# EAGLE schematic Register_file (EAGLE 9.4.2)
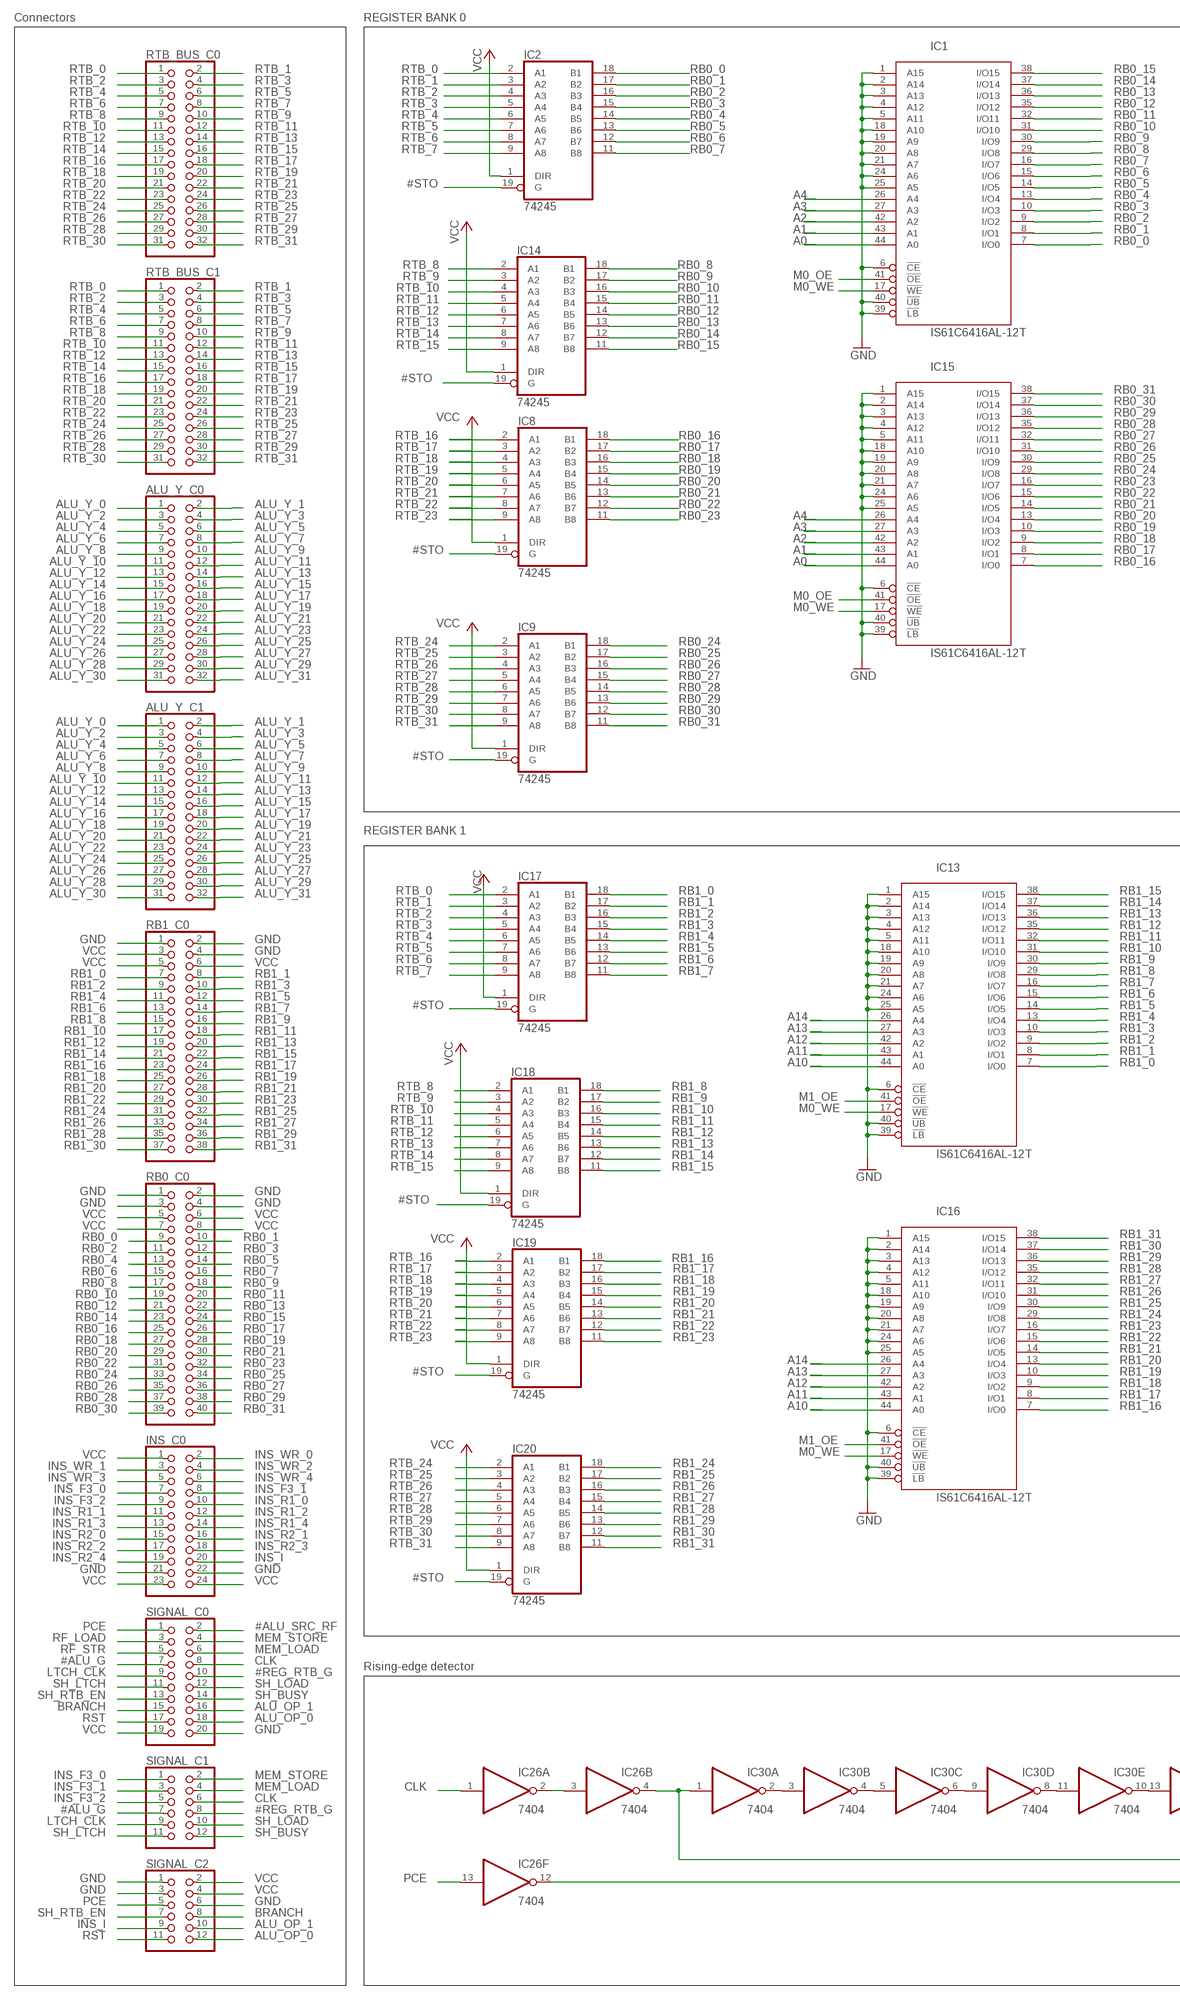
[diagram p0: schematic, sheet 1, part 1 of 2]
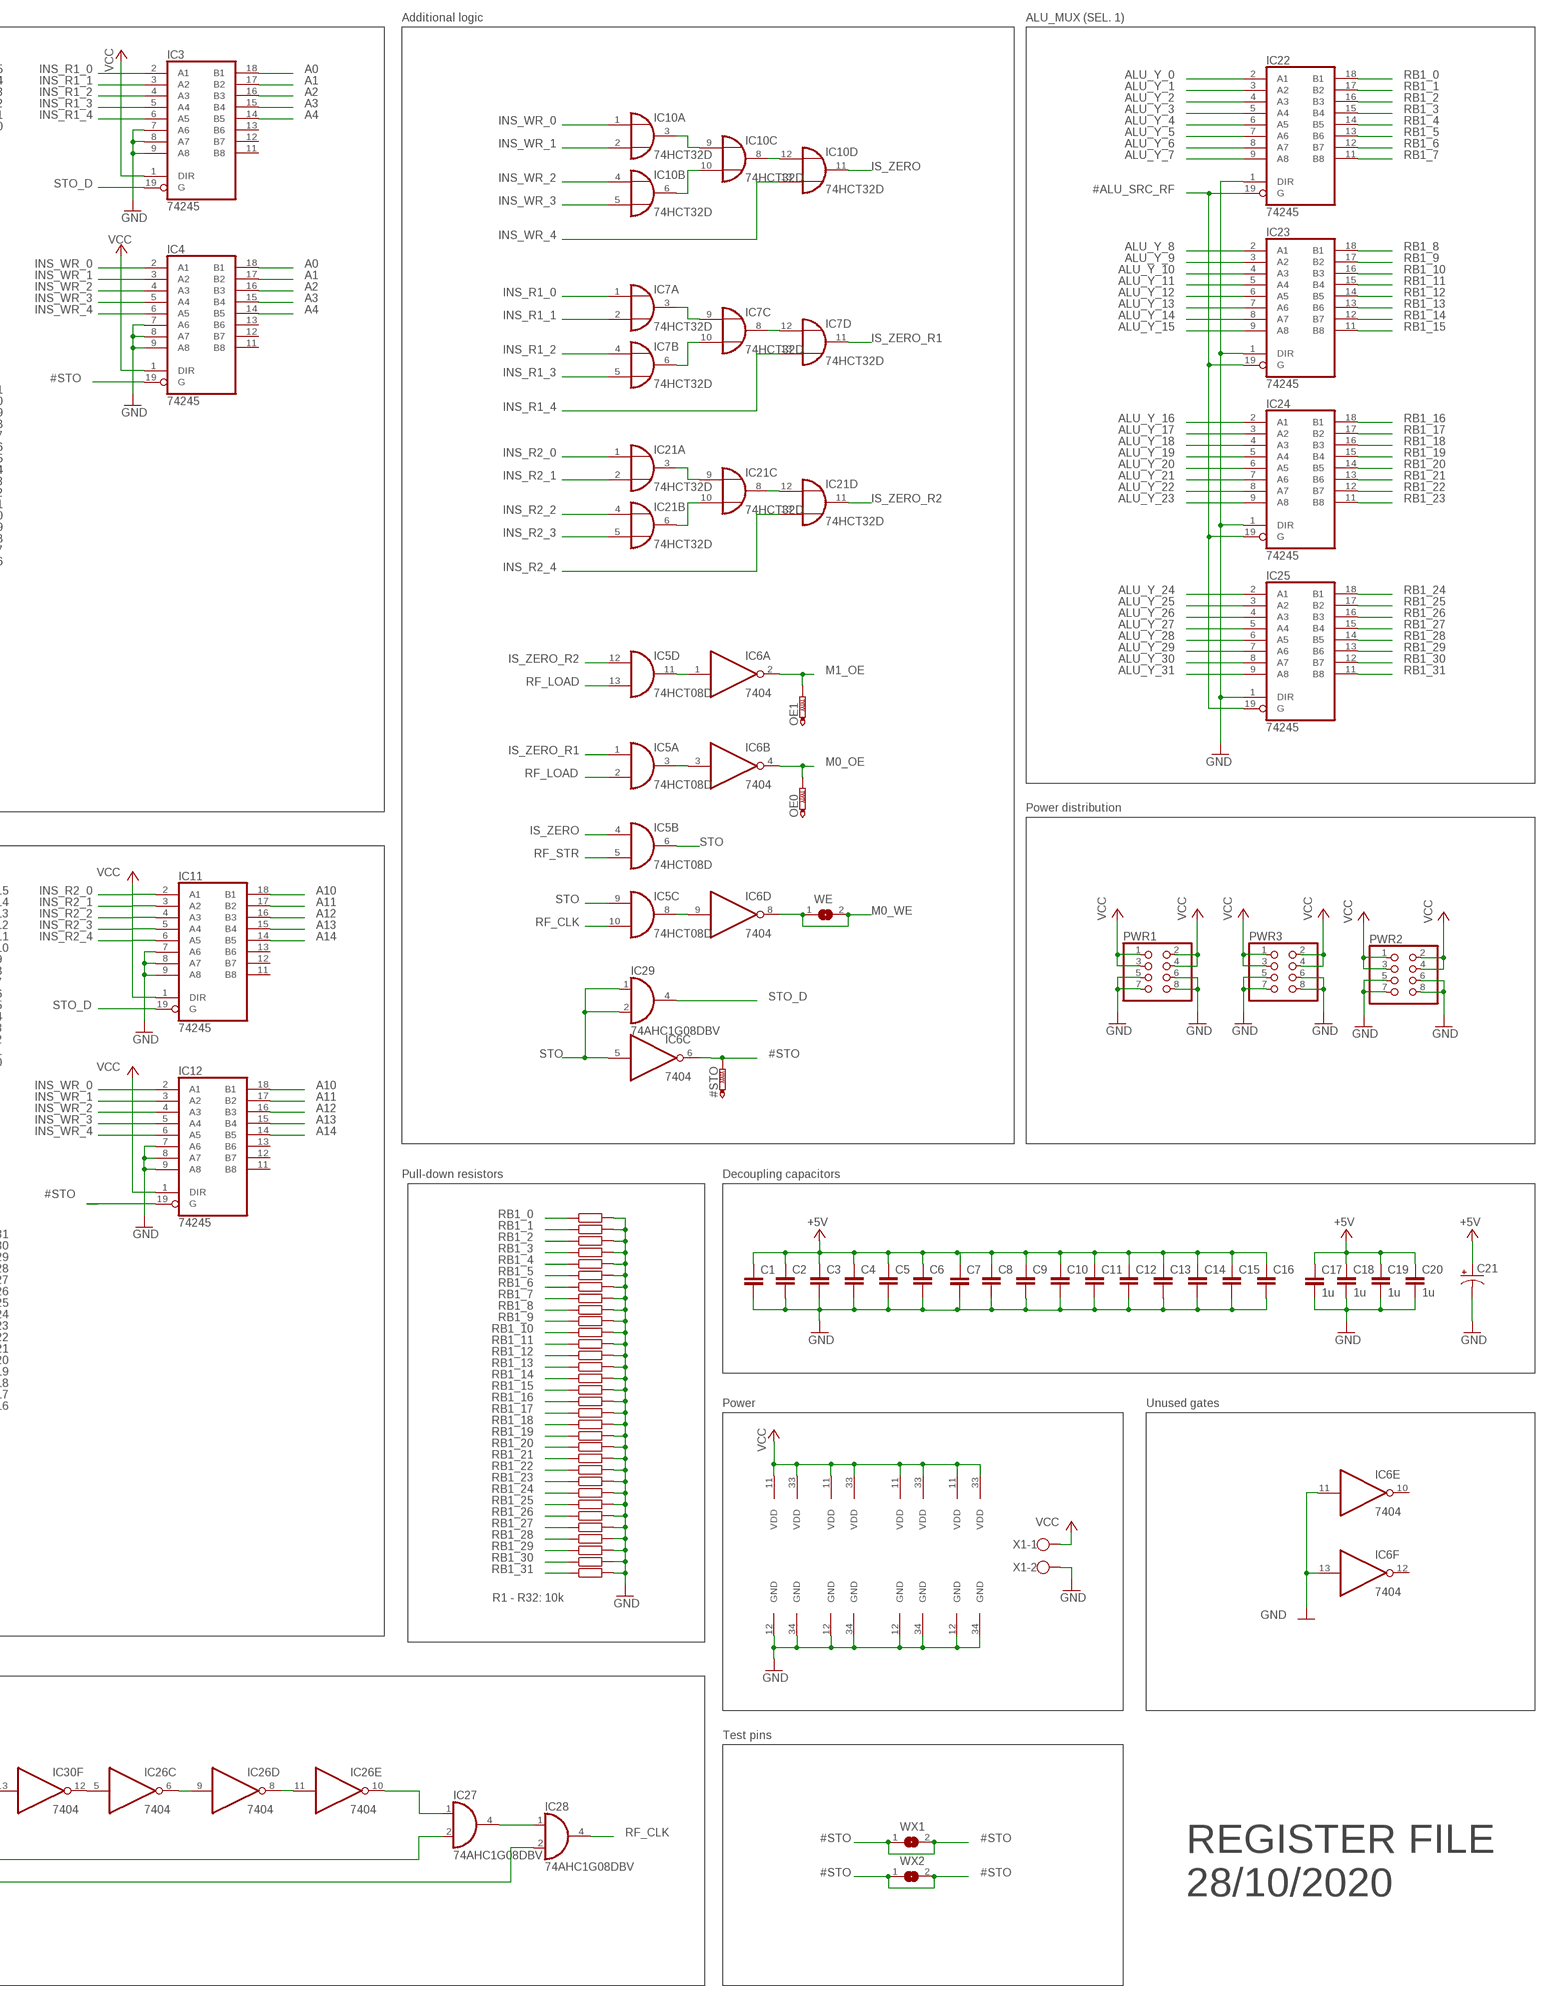
[diagram p1: schematic, sheet 1, part 2 of 2]

## Parts
#STO  PTR1B2,54  [B2,54]
ALU_Y_C0  PINHD-2X16  [2X16]
ALU_Y_C1  PINHD-2X16  [2X16]
C1  C-EUC0805  [C0805]
C2  C-EUC0805  [C0805]
C3  C-EUC0805  [C0805]
C4  C-EUC0805  [C0805]
C5  C-EUC0805  [C0805]
C6  C-EUC0805  [C0805]
C7  C-EUC0805  [C0805]
C8  C-EUC0805  [C0805]
C9  C-EUC0805  [C0805]
C10  C-EUC0805  [C0805]
C11  C-EUC0805  [C0805]
C12  C-EUC0805  [C0805]
C13  C-EUC0805  [C0805]
C14  C-EUC0805  [C0805]
C15  C-EUC0805  [C0805]
C16  C-EUC0805  [C0805]
C17  1u  C-EUC0805  [C0805]
C18  1u  C-EUC0805  [C0805]
C19  1u  C-EUC0805  [C0805]
C20  1u  C-EUC0805  [C0805]
C21  CAPACITOR-P153CLV-1010  [153CLV-1010]
IC1  IS61C6416AL-12T  [TSOP-II-44]
IC2  74245  [TSSOP20]
IC3  74245  [TSSOP20]
IC4  74245  [TSSOP20]
IC5  74HCT08D  [SO14]
IC6  7404  [TSSOP14]
IC7  74HCT32D  [SO14]
IC8  74245  [TSSOP20]
IC9  74245  [TSSOP20]
IC10  74HCT32D  [SO14]
IC11  74245  [TSSOP20]
IC12  74245  [TSSOP20]
IC13  IS61C6416AL-12T  [TSOP-II-44]
IC14  74245  [TSSOP20]
IC15  IS61C6416AL-12T  [TSOP-II-44]
IC16  IS61C6416AL-12T  [TSOP-II-44]
IC17  74245  [TSSOP20]
IC18  74245  [TSSOP20]
IC19  74245  [TSSOP20]
IC20  74245  [TSSOP20]
IC21  74HCT32D  [SO14]
IC22  74245  [TSSOP20]
IC23  74245  [TSSOP20]
IC24  74245  [TSSOP20]
IC25  74245  [TSSOP20]
IC26  7404  [TSSOP14]
IC27  74AHC1G08DBV  [SOT23-5]
IC28  74AHC1G08DBV  [SOT23-5]
IC29  74AHC1G08DBV  [SOT23-5]
IC30  7404  [TSSOP14]
INS_C0  PINHD-2X12  [2X12]
OE0  PTR1B2,54  [B2,54]
OE1  PTR1B2,54  [B2,54]
PWR1  PINHD-2X4  [2X04]
PWR2  PINHD-2X4  [2X04]
PWR3  PINHD-2X4  [2X04]
R33  R-EU_R0805  [R0805]
R34  R-EU_R0805  [R0805]
R35  R-EU_R0805  [R0805]
R36  R-EU_R0805  [R0805]
R37  R-EU_R0805  [R0805]
R38  R-EU_R0805  [R0805]
R39  R-EU_R0805  [R0805]
R40  R-EU_R0805  [R0805]
R41  R-EU_R0805  [R0805]
R42  R-EU_R0805  [R0805]
R43  R-EU_R0805  [R0805]
R44  R-EU_R0805  [R0805]
R45  R-EU_R0805  [R0805]
R46  R-EU_R0805  [R0805]
R47  R-EU_R0805  [R0805]
R48  R-EU_R0805  [R0805]
R49  R-EU_R0805  [R0805]
R50  R-EU_R0805  [R0805]
R51  R-EU_R0805  [R0805]
R52  R-EU_R0805  [R0805]
R53  R-EU_R0805  [R0805]
R54  R-EU_R0805  [R0805]
R55  R-EU_R0805  [R0805]
R56  R-EU_R0805  [R0805]
R57  R-EU_R0805  [R0805]
R58  R-EU_R0805  [R0805]
R59  R-EU_R0805  [R0805]
R60  R-EU_R0805  [R0805]
R61  R-EU_R0805  [R0805]
R62  R-EU_R0805  [R0805]
R63  R-EU_R0805  [R0805]
R64  R-EU_R0805  [R0805]
RB0_C0  PINHD-2X20  [2X20]
RB1_C0  PINHD-2X19  [2X19]
RTB_BUS_C0  PINHD-2X16  [2X16]
RTB_BUS_C1  PINHD-2X16  [2X16]
SIGNAL_C0  PINHD-2X10  [2X10]
SIGNAL_C1  PINHD-2X6  [2X06]
SIGNAL_C2  PINHD-2X6  [2X06]
WE  SJ  [SJ]
WX1  SJ  [SJ]
WX2  SJ  [SJ]
X1  W237-102  [W237-102]

## Nets
#ALU_G: SIGNAL_C0.7 SIGNAL_C1.7
#ALU_SRC_RF: IC22.19(G) IC23.19(G) IC24.19(G) IC25.19(G) SIGNAL_C0.2
#REG_RTB_G: SIGNAL_C0.10 SIGNAL_C1.8
#STO: #STO.TP IC2.19(G) IC4.19(G) IC6.6(C:O) IC8.19(G) IC9.19(G) IC12.19(G) IC14.19(G) IC17.19(G) IC18.19(G) IC19.19(G) IC20.19(G) WX1.1 WX1.2 WX2.1 WX2.2
A0: IC1.44(A0) IC3.18(B1) IC4.18(B1) IC15.44(A0)
A1: IC1.43(A1) IC3.17(B2) IC4.17(B2) IC15.43(A1)
A2: IC1.42(A2) IC3.16(B3) IC4.16(B3) IC15.42(A2)
A3: IC1.27(A3) IC3.15(B4) IC4.15(B4) IC15.27(A3)
A4: IC1.26(A4) IC3.14(B5) IC4.14(B5) IC15.26(A4)
A10: IC11.18(B1) IC12.18(B1) IC13.44(A0) IC16.44(A0)
A11: IC11.17(B2) IC12.17(B2) IC13.43(A1) IC16.43(A1)
A12: IC11.16(B3) IC12.16(B3) IC13.42(A2) IC16.42(A2)
A13: IC11.15(B4) IC12.15(B4) IC13.27(A3) IC16.27(A3)
A14: IC11.14(B5) IC12.14(B5) IC13.26(A4) IC16.26(A4)
ALU_OP_0: SIGNAL_C0.18 SIGNAL_C2.12
ALU_OP_1: SIGNAL_C0.16 SIGNAL_C2.10
ALU_Y_0: ALU_Y_C0.1 ALU_Y_C1.1 IC22.2(A1)
ALU_Y_1: ALU_Y_C0.2 ALU_Y_C1.2 IC22.3(A2)
ALU_Y_2: ALU_Y_C0.3 ALU_Y_C1.3 IC22.4(A3)
ALU_Y_3: ALU_Y_C0.4 ALU_Y_C1.4 IC22.5(A4)
ALU_Y_4: ALU_Y_C0.5 ALU_Y_C1.5 IC22.6(A5)
ALU_Y_5: ALU_Y_C0.6 ALU_Y_C1.6 IC22.7(A6)
ALU_Y_6: ALU_Y_C0.7 ALU_Y_C1.7 IC22.8(A7)
ALU_Y_7: ALU_Y_C0.8 ALU_Y_C1.8 IC22.9(A8)
ALU_Y_8: ALU_Y_C0.9 ALU_Y_C1.9 IC23.2(A1)
ALU_Y_9: ALU_Y_C0.10 ALU_Y_C1.10 IC23.3(A2)
ALU_Y_10: ALU_Y_C0.11 ALU_Y_C1.11 IC23.4(A3)
ALU_Y_11: ALU_Y_C0.12 ALU_Y_C1.12 IC23.5(A4)
ALU_Y_12: ALU_Y_C0.13 ALU_Y_C1.13 IC23.6(A5)
ALU_Y_13: ALU_Y_C0.14 ALU_Y_C1.14 IC23.7(A6)
ALU_Y_14: ALU_Y_C0.15 ALU_Y_C1.15 IC23.8(A7)
ALU_Y_15: ALU_Y_C0.16 ALU_Y_C1.16 IC23.9(A8)
ALU_Y_16: ALU_Y_C0.17 ALU_Y_C1.17 IC24.2(A1)
ALU_Y_17: ALU_Y_C0.18 ALU_Y_C1.18 IC24.3(A2)
ALU_Y_18: ALU_Y_C0.19 ALU_Y_C1.19 IC24.4(A3)
ALU_Y_19: ALU_Y_C0.20 ALU_Y_C1.20 IC24.5(A4)
ALU_Y_20: ALU_Y_C0.21 ALU_Y_C1.21 IC24.6(A5)
ALU_Y_21: ALU_Y_C0.22 ALU_Y_C1.22 IC24.7(A6)
ALU_Y_22: ALU_Y_C0.23 ALU_Y_C1.23 IC24.8(A7)
ALU_Y_23: ALU_Y_C0.24 ALU_Y_C1.24 IC24.9(A8)
ALU_Y_24: ALU_Y_C0.25 ALU_Y_C1.25 IC25.2(A1)
ALU_Y_25: ALU_Y_C0.26 ALU_Y_C1.26 IC25.3(A2)
ALU_Y_26: ALU_Y_C0.27 ALU_Y_C1.27 IC25.4(A3)
ALU_Y_27: ALU_Y_C0.28 ALU_Y_C1.28 IC25.5(A4)
ALU_Y_28: ALU_Y_C0.29 ALU_Y_C1.29 IC25.6(A5)
ALU_Y_29: ALU_Y_C0.30 ALU_Y_C1.30 IC25.7(A6)
ALU_Y_30: ALU_Y_C0.31 ALU_Y_C1.31 IC25.8(A7)
ALU_Y_31: ALU_Y_C0.32 ALU_Y_C1.32 IC25.9(A8)
BRANCH: SIGNAL_C0.15 SIGNAL_C2.8
CLK: IC26.1(A:I) SIGNAL_C0.8 SIGNAL_C1.6
GND: C1.2 C2.2 C3.2 C4.2 C5.2 C6.2 C7.2 C8.2 C9.2 C10.2 C11.2 C12.2 C13.2 C14.2 C15.2 C16.2 C17.2 C18.2 C19.2 C20.2 C21.- IC1.1(A15) IC1.2(A14) IC1.3(A13) IC1.4(A12) IC1.5(A11) IC1.6(!CE) IC1.12(GND) IC1.18(A10) IC1.19(A9) IC1.20(A8) IC1.21(A7) IC1.24(A6) IC1.25(A5) IC1.34(GND) IC1.39(!LB) IC1.40(!UB) IC3.7(A6) IC3.8(A7) IC3.9(A8) IC4.7(A6) IC4.8(A7) IC4.9(A8) IC6.11(E:I) IC6.13(F:I) IC11.7(A6) IC11.8(A7) IC11.9(A8) IC12.7(A6) IC12.8(A7) IC12.9(A8) IC13.1(A15) IC13.2(A14) IC13.3(A13) IC13.4(A12) IC13.5(A11) IC13.6(!CE) IC13.12(GND) IC13.18(A10) IC13.19(A9) IC13.20(A8) IC13.21(A7) IC13.24(A6) IC13.25(A5) IC13.34(GND) IC13.39(!LB) IC13.40(!UB) IC15.1(A15) IC15.2(A14) IC15.3(A13) IC15.4(A12) IC15.5(A11) IC15.6(!CE) IC15.12(GND) IC15.18(A10) IC15.19(A9) IC15.20(A8) IC15.21(A7) IC15.24(A6) IC15.25(A5) IC15.34(GND) IC15.39(!LB) IC15.40(!UB) IC16.1(A15) IC16.2(A14) IC16.3(A13) IC16.4(A12) IC16.5(A11) IC16.6(!CE) IC16.12(GND) IC16.18(A10) IC16.19(A9) IC16.20(A8) IC16.21(A7) IC16.24(A6) IC16.25(A5) IC16.34(GND) IC16.39(!LB) IC16.40(!UB) IC22.1(DIR) IC23.1(DIR) IC24.1(DIR) IC25.1(DIR) INS_C0.21 INS_C0.22 PWR1.5 PWR1.6 PWR1.7 PWR1.8 PWR2.5 PWR2.6 PWR2.7 PWR2.8 PWR3.5 PWR3.6 PWR3.7 PWR3.8 R33.2 R34.2 R35.2 R36.2 R37.2 R38.2 R39.2 R40.2 R41.2 R42.2 R43.2 R44.2 R45.2 R46.2 R47.2 R48.2 R49.2 R50.2 R51.2 R52.2 R53.2 R54.2 R55.2 R56.2 R57.2 R58.2 R59.2 R60.2 R61.2 R62.2 R63.2 R64.2 RB0_C0.1 RB0_C0.2 RB0_C0.3 RB0_C0.4 RB1_C0.1 RB1_C0.2 RB1_C0.4 SIGNAL_C0.20 SIGNAL_C2.1 SIGNAL_C2.3 SIGNAL_C2.6 X1.2
INS_F3_0: INS_C0.7 SIGNAL_C1.1
INS_F3_1: INS_C0.8 SIGNAL_C1.3
INS_F3_2: INS_C0.9 SIGNAL_C1.5
INS_I: INS_C0.20 SIGNAL_C2.9
INS_R1_0: IC3.2(A1) IC7.1(A:I0) INS_C0.10
INS_R1_1: IC3.3(A2) IC7.2(A:I1) INS_C0.11
INS_R1_2: IC3.4(A3) IC7.4(B:I0) INS_C0.12
INS_R1_3: IC3.5(A4) IC7.5(B:I1) INS_C0.13
INS_R1_4: IC3.6(A5) IC7.13(D:I1) INS_C0.14
INS_R2_0: IC11.2(A1) IC21.1(A:I0) INS_C0.15
INS_R2_1: IC11.3(A2) IC21.2(A:I1) INS_C0.16
INS_R2_2: IC11.4(A3) IC21.4(B:I0) INS_C0.17
INS_R2_3: IC11.5(A4) IC21.5(B:I1) INS_C0.18
INS_R2_4: IC11.6(A5) IC21.13(D:I1) INS_C0.19
INS_WR_0: IC4.2(A1) IC10.1(A:I0) IC12.2(A1) INS_C0.2
INS_WR_1: IC4.3(A2) IC10.2(A:I1) IC12.3(A2) INS_C0.3
INS_WR_2: IC4.4(A3) IC10.4(B:I0) IC12.4(A3) INS_C0.4
INS_WR_3: IC4.5(A4) IC10.5(B:I1) IC12.5(A4) INS_C0.5
INS_WR_4: IC4.6(A5) IC10.13(D:I1) IC12.6(A5) INS_C0.6
IS_ZERO: IC5.4(B:I0) IC10.11(D:O)
IS_ZERO_R1: IC5.1(A:I0) IC7.11(D:O)
IS_ZERO_R2: IC5.12(D:I0) IC21.11(D:O)
LTCH_CLK: SIGNAL_C0.9 SIGNAL_C1.9
M0_OE: IC1.41(!OE) IC6.4(B:O) IC15.41(!OE) OE0.TP
M0_WE: IC1.17(!WE) IC6.8(D:O) IC13.17(!WE) IC15.17(!WE) IC16.17(!WE) WE.1 WE.2
M1_OE: IC6.2(A:O) IC13.41(!OE) IC16.41(!OE) OE1.TP
MEM_LOAD: SIGNAL_C0.6 SIGNAL_C1.4
MEM_STORE: SIGNAL_C0.4 SIGNAL_C1.2
N$1: IC7.3(A:O) IC7.9(C:I0)
N$2: IC7.6(B:O) IC7.10(C:I1)
N$3: IC10.3(A:O) IC10.9(C:I0)
N$4: IC10.6(B:O) IC10.10(C:I1)
N$5: IC10.8(C:O) IC10.12(D:I0)
N$6: IC7.8(C:O) IC7.12(D:I0)
N$7: IC5.3(A:O) IC6.3(B:I)
N$8: IC5.8(C:O) IC6.9(D:I)
N$9: IC21.3(A:O) IC21.9(C:I0)
N$10: IC21.6(B:O) IC21.10(C:I1)
N$11: IC21.8(C:O) IC21.12(D:I0)
N$12: IC5.11(D:O) IC6.1(A:I)
N$13: IC30.2(A:O) IC30.3(B:I)
N$14: IC30.4(B:O) IC30.5(C:I)
N$15: IC30.6(C:O) IC30.9(D:I)
N$16: IC26.2(A:O) IC26.3(B:I)
N$17: IC26.4(B:O) IC27.2(I1) IC30.1(A:I)
N$18: IC26.6(C:O) IC26.9(D:I)
N$19: IC26.8(D:O) IC26.11(E:I)
N$20: IC26.10(E:O) IC27.1(I0)
N$21: IC27.4(O) IC28.1(I0)
N$22: IC26.12(F:O) IC28.2(I1)
N$23: IC30.8(D:O) IC30.11(E:I)
N$24: IC30.10(E:O) IC30.13(F:I)
N$25: IC26.5(C:I) IC30.12(F:O)
PCE: IC26.13(F:I) SIGNAL_C0.1 SIGNAL_C2.5
RB0_0: IC1.7(I/O0) IC2.18(B1) RB0_C0.9
RB0_1: IC1.8(I/O1) IC2.17(B2) RB0_C0.10
RB0_2: IC1.9(I/O2) IC2.16(B3) RB0_C0.11
RB0_3: IC1.10(I/O3) IC2.15(B4) RB0_C0.12
RB0_4: IC1.13(I/O4) IC2.14(B5) RB0_C0.13
RB0_5: IC1.14(I/O5) IC2.13(B6) RB0_C0.14
RB0_6: IC1.15(I/O6) IC2.12(B7) RB0_C0.15
RB0_7: IC1.16(I/O7) IC2.11(B8) RB0_C0.16
RB0_8: IC1.29(I/O8) IC14.18(B1) RB0_C0.17
RB0_9: IC1.30(I/O9) IC14.17(B2) RB0_C0.18
RB0_10: IC1.31(I/O10) IC14.16(B3) RB0_C0.19
RB0_11: IC1.32(I/O11) IC14.15(B4) RB0_C0.20
RB0_12: IC1.35(I/O12) IC14.14(B5) RB0_C0.21
RB0_13: IC1.36(I/O13) IC14.13(B6) RB0_C0.22
RB0_14: IC1.37(I/O14) IC14.12(B7) RB0_C0.23
RB0_15: IC1.38(I/O15) IC14.11(B8) RB0_C0.24
RB0_16: IC8.18(B1) IC15.7(I/O0) RB0_C0.25
RB0_17: IC8.17(B2) IC15.8(I/O1) RB0_C0.26
RB0_18: IC8.16(B3) IC15.9(I/O2) RB0_C0.27
RB0_19: IC8.15(B4) IC15.10(I/O3) RB0_C0.28
RB0_20: IC8.14(B5) IC15.13(I/O4) RB0_C0.29
RB0_21: IC8.13(B6) IC15.14(I/O5) RB0_C0.30
RB0_22: IC8.12(B7) IC15.15(I/O6) RB0_C0.31
RB0_23: IC8.11(B8) IC15.16(I/O7) RB0_C0.32
RB0_24: IC9.18(B1) IC15.29(I/O8) RB0_C0.33
RB0_25: IC9.17(B2) IC15.30(I/O9) RB0_C0.34
RB0_26: IC9.16(B3) IC15.31(I/O10) RB0_C0.35
RB0_27: IC9.15(B4) IC15.32(I/O11) RB0_C0.36
RB0_28: IC9.14(B5) IC15.35(I/O12) RB0_C0.37
RB0_29: IC9.13(B6) IC15.36(I/O13) RB0_C0.38
RB0_30: IC9.12(B7) IC15.37(I/O14) RB0_C0.39
RB0_31: IC9.11(B8) IC15.38(I/O15) RB0_C0.40
RB1_0: IC13.7(I/O0) IC17.18(B1) IC22.18(B1) R33.1 RB1_C0.7
RB1_1: IC13.8(I/O1) IC17.17(B2) IC22.17(B2) R34.1 RB1_C0.8
RB1_2: IC13.9(I/O2) IC17.16(B3) IC22.16(B3) R35.1 RB1_C0.9
RB1_3: IC13.10(I/O3) IC17.15(B4) IC22.15(B4) R36.1 RB1_C0.10
RB1_4: IC13.13(I/O4) IC17.14(B5) IC22.14(B5) R37.1 RB1_C0.11
RB1_5: IC13.14(I/O5) IC17.13(B6) IC22.13(B6) R38.1 RB1_C0.12
RB1_6: IC13.15(I/O6) IC17.12(B7) IC22.12(B7) R39.1 RB1_C0.13
RB1_7: IC13.16(I/O7) IC17.11(B8) IC22.11(B8) R40.1 RB1_C0.14
RB1_8: IC13.29(I/O8) IC18.18(B1) IC23.18(B1) R41.1 RB1_C0.15
RB1_9: IC13.30(I/O9) IC18.17(B2) IC23.17(B2) R42.1 RB1_C0.16
RB1_10: IC13.31(I/O10) IC18.16(B3) IC23.16(B3) R43.1 RB1_C0.17
RB1_11: IC13.32(I/O11) IC18.15(B4) IC23.15(B4) R44.1 RB1_C0.18
RB1_12: IC13.35(I/O12) IC18.14(B5) IC23.14(B5) R45.1 RB1_C0.19
RB1_13: IC13.36(I/O13) IC18.13(B6) IC23.13(B6) R46.1 RB1_C0.20
RB1_14: IC13.37(I/O14) IC18.12(B7) IC23.12(B7) R47.1 RB1_C0.21
RB1_15: IC13.38(I/O15) IC18.11(B8) IC23.11(B8) R48.1 RB1_C0.22
RB1_16: IC16.7(I/O0) IC19.18(B1) IC24.18(B1) R49.1 RB1_C0.23
RB1_17: IC16.8(I/O1) IC19.17(B2) IC24.17(B2) R50.1 RB1_C0.24
RB1_18: IC16.9(I/O2) IC19.16(B3) IC24.16(B3) R51.1 RB1_C0.25
RB1_19: IC16.10(I/O3) IC19.15(B4) IC24.15(B4) R52.1 RB1_C0.26
RB1_20: IC16.13(I/O4) IC19.14(B5) IC24.14(B5) R53.1 RB1_C0.27
RB1_21: IC16.14(I/O5) IC19.13(B6) IC24.13(B6) R54.1 RB1_C0.28
RB1_22: IC16.15(I/O6) IC19.12(B7) IC24.12(B7) R55.1 RB1_C0.29
RB1_23: IC16.16(I/O7) IC19.11(B8) IC24.11(B8) R56.1 RB1_C0.30
RB1_24: IC16.29(I/O8) IC20.18(B1) IC25.18(B1) R57.1 RB1_C0.31
RB1_25: IC16.30(I/O9) IC20.17(B2) IC25.17(B2) R58.1 RB1_C0.32
RB1_26: IC16.31(I/O10) IC20.16(B3) IC25.16(B3) R59.1 RB1_C0.33
RB1_27: IC16.32(I/O11) IC20.15(B4) IC25.15(B4) R60.1 RB1_C0.34
RB1_28: IC16.35(I/O12) IC20.14(B5) IC25.14(B5) R61.1 RB1_C0.35
RB1_29: IC16.36(I/O13) IC20.13(B6) IC25.13(B6) R62.1 RB1_C0.36
RB1_30: IC16.37(I/O14) IC20.12(B7) IC25.12(B7) R63.1 RB1_C0.37
RB1_31: IC16.38(I/O15) IC20.11(B8) IC25.11(B8) R64.1 RB1_C0.38
RF_CLK: IC5.10(C:I1) IC28.4(O)
RF_LOAD: IC5.2(A:I1) IC5.13(D:I1) SIGNAL_C0.3
RF_STR: IC5.5(B:I1) SIGNAL_C0.5
RST: SIGNAL_C0.17 SIGNAL_C2.11
RTB_0: IC2.2(A1) IC17.2(A1) RTB_BUS_C0.1 RTB_BUS_C1.1
RTB_1: IC2.3(A2) IC17.3(A2) RTB_BUS_C0.2 RTB_BUS_C1.2
RTB_2: IC2.4(A3) IC17.4(A3) RTB_BUS_C0.3 RTB_BUS_C1.3
RTB_3: IC2.5(A4) IC17.5(A4) RTB_BUS_C0.4 RTB_BUS_C1.4
RTB_4: IC2.6(A5) IC17.6(A5) RTB_BUS_C0.5 RTB_BUS_C1.5
RTB_5: IC2.7(A6) IC17.7(A6) RTB_BUS_C0.6 RTB_BUS_C1.6
RTB_6: IC2.8(A7) IC17.8(A7) RTB_BUS_C0.7 RTB_BUS_C1.7
RTB_7: IC2.9(A8) IC17.9(A8) RTB_BUS_C0.8 RTB_BUS_C1.8
RTB_8: IC14.2(A1) IC18.2(A1) RTB_BUS_C0.9 RTB_BUS_C1.9
RTB_9: IC14.3(A2) IC18.3(A2) RTB_BUS_C0.10 RTB_BUS_C1.10
RTB_10: IC14.4(A3) IC18.4(A3) RTB_BUS_C0.11 RTB_BUS_C1.11
RTB_11: IC14.5(A4) IC18.5(A4) RTB_BUS_C0.12 RTB_BUS_C1.12
RTB_12: IC14.6(A5) IC18.6(A5) RTB_BUS_C0.13 RTB_BUS_C1.13
RTB_13: IC14.7(A6) IC18.7(A6) RTB_BUS_C0.14 RTB_BUS_C1.14
RTB_14: IC14.8(A7) IC18.8(A7) RTB_BUS_C0.15 RTB_BUS_C1.15
RTB_15: IC14.9(A8) IC18.9(A8) RTB_BUS_C0.16 RTB_BUS_C1.16
RTB_16: IC8.2(A1) IC19.2(A1) RTB_BUS_C0.17 RTB_BUS_C1.17
RTB_17: IC8.3(A2) IC19.3(A2) RTB_BUS_C0.18 RTB_BUS_C1.18
RTB_18: IC8.4(A3) IC19.4(A3) RTB_BUS_C0.19 RTB_BUS_C1.19
RTB_19: IC8.5(A4) IC19.5(A4) RTB_BUS_C0.20 RTB_BUS_C1.20
RTB_20: IC8.6(A5) IC19.6(A5) RTB_BUS_C0.21 RTB_BUS_C1.21
RTB_21: IC8.7(A6) IC19.7(A6) RTB_BUS_C0.22 RTB_BUS_C1.22
RTB_22: IC8.8(A7) IC19.8(A7) RTB_BUS_C0.23 RTB_BUS_C1.23
RTB_23: IC8.9(A8) IC19.9(A8) RTB_BUS_C0.24 RTB_BUS_C1.24
RTB_24: IC9.2(A1) IC20.2(A1) RTB_BUS_C0.25 RTB_BUS_C1.25
RTB_25: IC9.3(A2) IC20.3(A2) RTB_BUS_C0.26 RTB_BUS_C1.26
RTB_26: IC9.4(A3) IC20.4(A3) RTB_BUS_C0.27 RTB_BUS_C1.27
RTB_27: IC9.5(A4) IC20.5(A4) RTB_BUS_C0.28 RTB_BUS_C1.28
RTB_28: IC9.6(A5) IC20.6(A5) RTB_BUS_C0.29 RTB_BUS_C1.29
RTB_29: IC9.7(A6) IC20.7(A6) RTB_BUS_C0.30 RTB_BUS_C1.30
RTB_30: IC9.8(A7) IC20.8(A7) RTB_BUS_C0.31 RTB_BUS_C1.31
RTB_31: IC9.9(A8) IC20.9(A8) RTB_BUS_C0.32 RTB_BUS_C1.32
SH_BUSY: SIGNAL_C0.14 SIGNAL_C1.12
SH_LOAD: SIGNAL_C0.12 SIGNAL_C1.10
SH_LTCH: SIGNAL_C0.11 SIGNAL_C1.11
SH_RTB_EN: SIGNAL_C0.13 SIGNAL_C2.7
STO: IC5.6(B:O) IC5.9(C:I0) IC6.5(C:I) IC29.1(I0) IC29.2(I1)
STO_D: IC3.19(G) IC11.19(G) IC29.4(O)
VCC: C1.1 C2.1 C3.1 C4.1 C5.1 C6.1 C7.1 C8.1 C9.1 C10.1 C11.1 C12.1 C13.1 C14.1 C15.1 C16.1 C17.1 C18.1 C19.1 C20.1 C21.+ IC1.11(VDD) IC1.33(VDD) IC2.1(DIR) IC3.1(DIR) IC4.1(DIR) IC8.1(DIR) IC9.1(DIR) IC11.1(DIR) IC12.1(DIR) IC13.11(VDD) IC13.33(VDD) IC14.1(DIR) IC15.11(VDD) IC15.33(VDD) IC16.11(VDD) IC16.33(VDD) IC17.1(DIR) IC18.1(DIR) IC19.1(DIR) IC20.1(DIR) INS_C0.1 INS_C0.23 INS_C0.24 PWR1.1 PWR1.2 PWR1.3 PWR1.4 PWR2.1 PWR2.2 PWR2.3 PWR2.4 PWR3.1 PWR3.2 PWR3.3 PWR3.4 RB0_C0.5 RB0_C0.6 RB0_C0.7 RB0_C0.8 RB1_C0.3 RB1_C0.5 RB1_C0.6 SIGNAL_C0.19 SIGNAL_C2.2 SIGNAL_C2.4 X1.1 ; supply symbol labelled +5V
Unconnected: IC3.11(B8) IC3.12(B7) IC3.13(B6) IC4.11(B8) IC4.12(B7) IC4.13(B6) IC6.10(E:O) IC6.12(F:O) IC11.11(B8) IC11.12(B7) IC11.13(B6) IC12.11(B8) IC12.12(B7) IC12.13(B6)

## Notes on the sheet
- Connectors | REGISTER BANK 0 | Additional logic | ALU_MUX (SEL. 1)
- Power distribution
- REGISTER BANK 1
- Pull-down resistors | Decoupling capacitors
- Power | Unused gates
- R1 - R32: 10k
- Rising-edge detector
- Test pins
- REGISTER FILE
  28/10/2020

## Power pins joined to a net without a drawn wire
GND: IC2.10(GND) IC3.10(GND) IC4.10(GND) IC5.7(P:GND) IC6.7(P:GND) IC7.7(P:GND) IC8.10(GND) IC9.10(GND) IC10.7(P:GND) IC11.10(GND) IC12.10(GND) IC14.10(GND) IC17.10(GND) IC18.10(GND) IC19.10(GND) IC20.10(GND) IC21.7(P:GND) IC22.10(GND) IC23.10(GND) IC24.10(GND) IC25.10(GND) IC26.7(P:GND) IC27.3(GND) IC28.3(GND) IC29.3(GND) IC30.7(P:GND)
VCC: IC2.20(VCC) IC3.20(VCC) IC4.20(VCC) IC5.14(P:VCC) IC6.14(P:VCC) IC7.14(P:VCC) IC8.20(VCC) IC9.20(VCC) IC10.14(P:VCC) IC11.20(VCC) IC12.20(VCC) IC14.20(VCC) IC17.20(VCC) IC18.20(VCC) IC19.20(VCC) IC20.20(VCC) IC21.14(P:VCC) IC22.20(VCC) IC23.20(VCC) IC24.20(VCC) IC25.20(VCC) IC26.14(P:VCC) IC27.5(VCC) IC28.5(VCC) IC29.5(VCC) IC30.14(P:VCC)

## Library data of the parts
#STO OE0 OE1 = testpad:PTR1: TEST PIN
ALU_Y_C0 RTB_BUS_C1 = pinhead_bottom:PINHD-2X16: PIN HEADER
ALU_Y_C1 RTB_BUS_C0 = pinhead:PINHD-2X16: PIN HEADER
C1-C20 = rcl:C-EU: CAPACITOR, European symbol; SPICEPREFIX: C
C21 = BeagleBone_Blue_R3:CAPACITOR-P: POLARIZED CAPACITOR, American symbol
IC1 IC13 IC15 IC16 = memory-issi-asynsram:IS61C6416AL-*: 64k x 16 high- speed CMOS static RAM 12ns access time 5V power supply
IC2-IC4 IC8 IC9 IC11 IC12 IC14 IC17-IC20 IC22-IC25 = AAA__74xx-eu:74*245: Octal BUS TRANSCEIVER, 3-state
IC5 = AAA__74xx-eu:74*08: Quad 2-input AND gate
IC6 IC26 IC30 = AAA__74xx-eu:74*04: Hex INVERTER
IC7 IC10 IC21 = AAA__74xx-eu:74*32: Quad 2-input OR gate
IC27-IC29 = 74xx-little-de:74*1G08: 2-input AND gate
INS_C0 = pinhead_bottom:PINHD-2X12: PIN HEADER
PWR1 PWR3 = pinhead_bottom:PINHD-2X4: PIN HEADER
PWR2 = pinhead:PINHD-2X4: PIN HEADER
R33-R64 = rcl:R-EU_: RESISTOR, European symbol; SPICEPREFIX: R
RB0_C0 = pinhead:PINHD-2X20: PIN HEADER
RB1_C0 = pinhead:PINHD-2X19: PIN HEADER
SIGNAL_C0 = pinhead_bottom:PINHD-2X10: PIN HEADER
SIGNAL_C1 SIGNAL_C2 = pinhead:PINHD-2X6: PIN HEADER
WE WX1 WX2 = jumper:SJ: SMD solder JUMPER
X1 = con-wago-500:W237-102: WAGO SCREW CLAMP; MPN: 237-102; OC_FARNELL: unknown; OC_NEWARK: 70K9898